# EAGLE design ic-mhm-encoder-v2 (EAGLE 9.6.2)
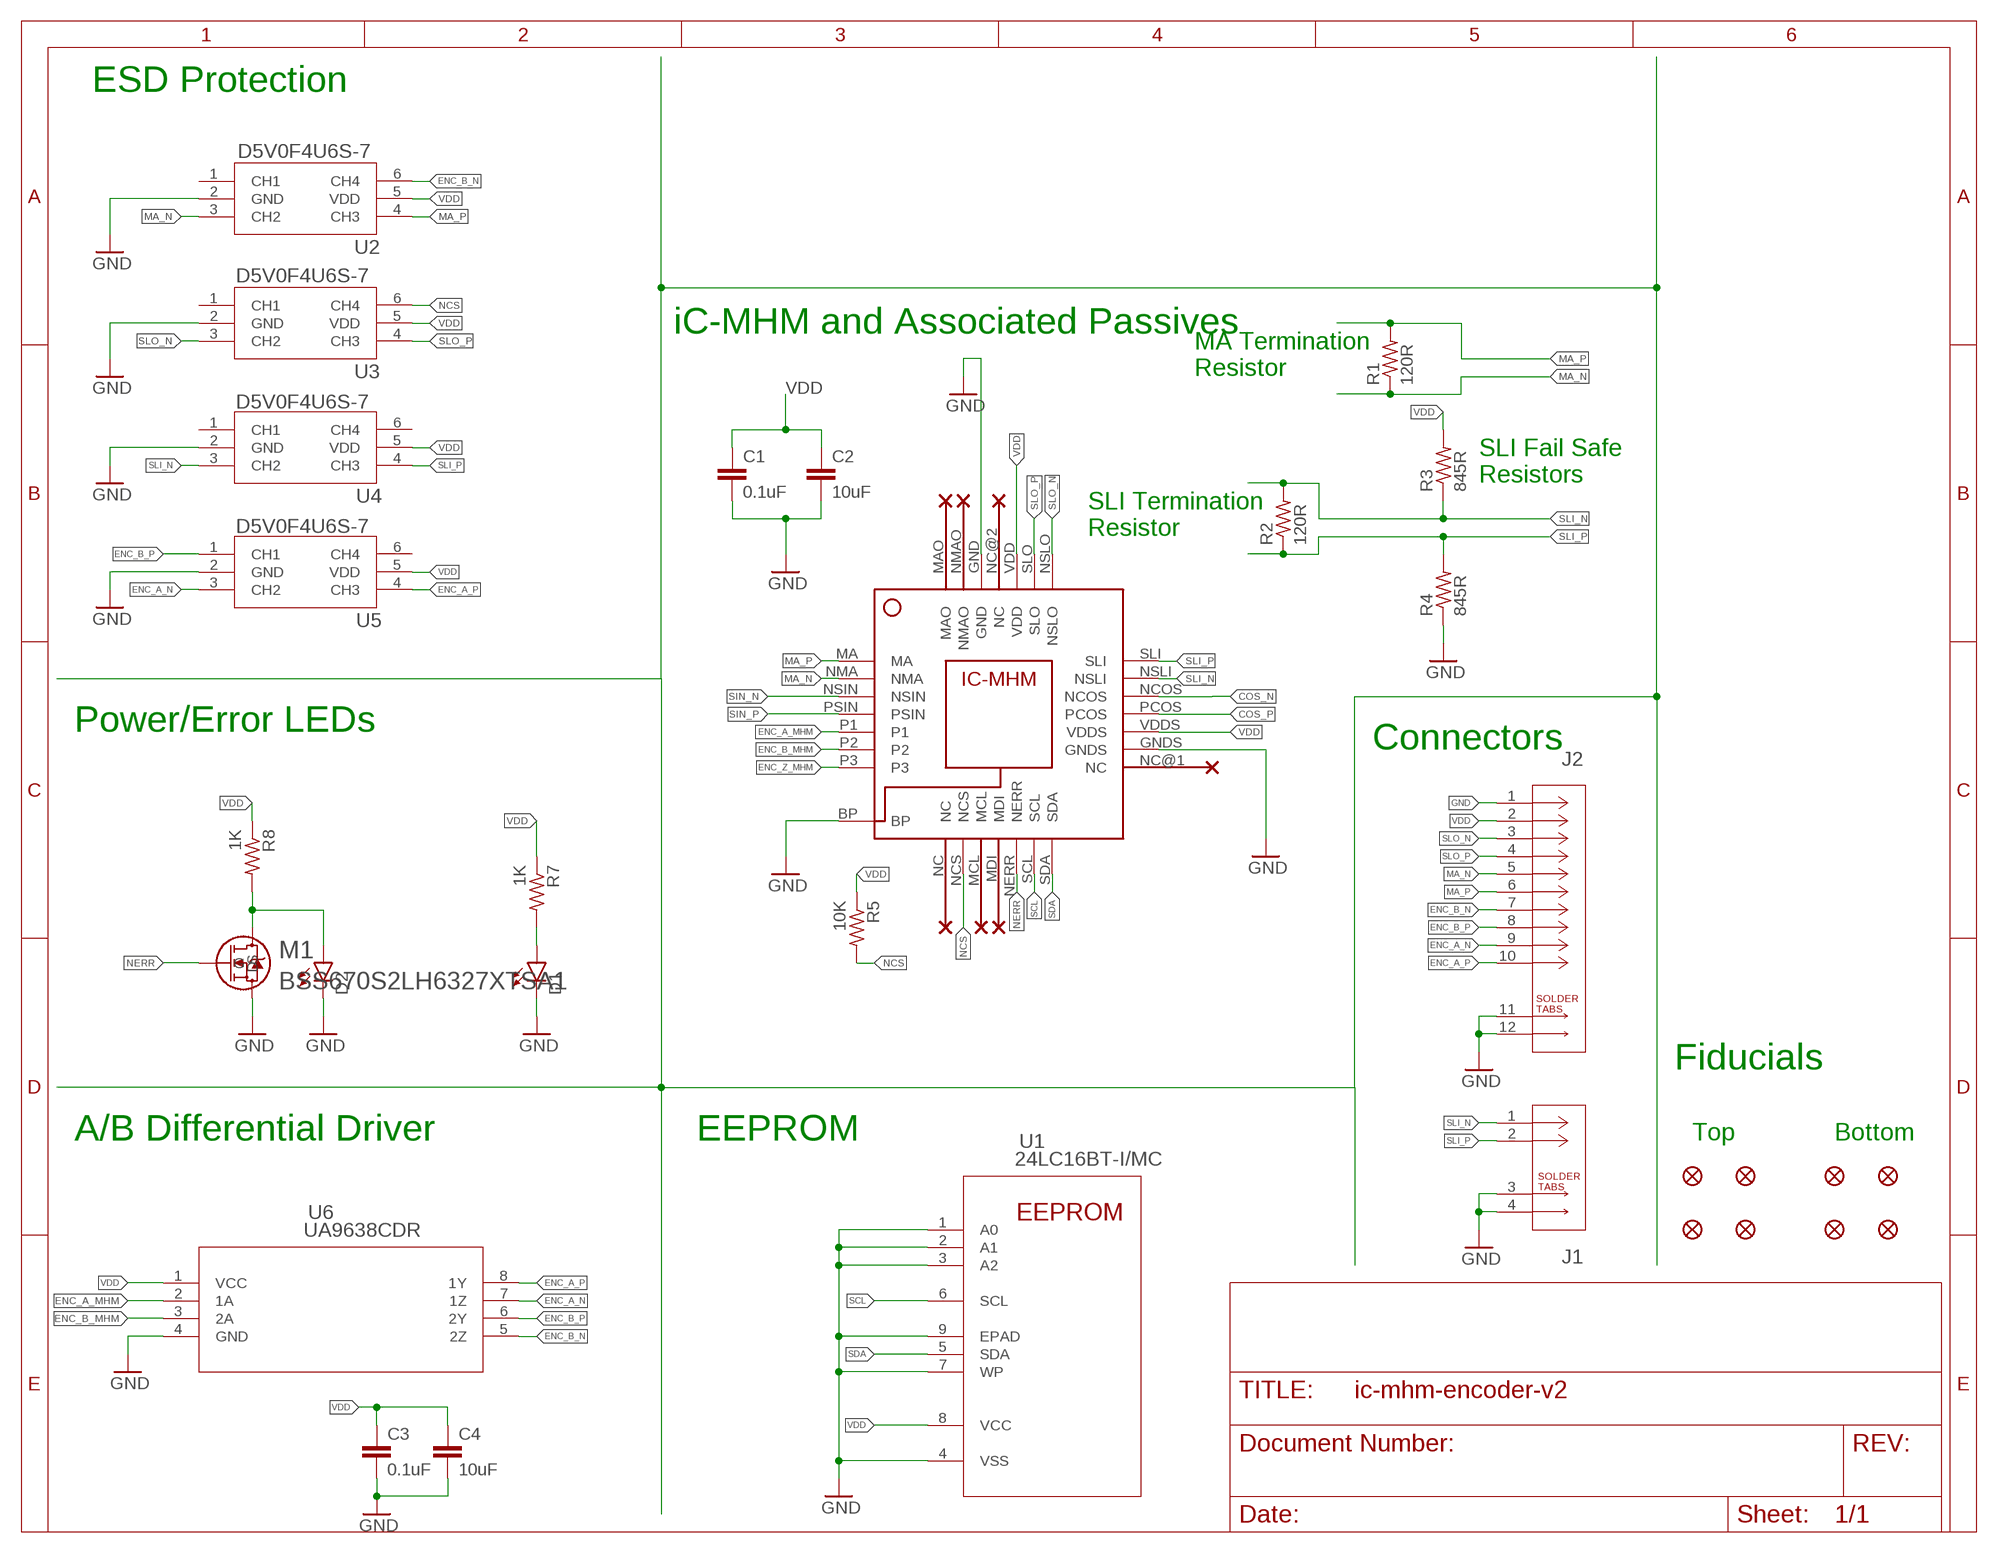
[diagram p0: schematic, sheet 1]

## Parts
C1  0.1uF  C-EUC0603  [C0603]
C2  10uF  C-EUC0603  [C0603]
C3  0.1uF  C-EUC0603  [C0603]
C4  10uF  C-EUC0603  [C0603]
D1  LEDSML0603  [SML0603]
D2  LEDSML0603  [SML0603]
FID1  FIDUCIAL_1MM  [FIDUCIAL_1MM]
FID2  FIDUCIAL_1MM  [FIDUCIAL_1MM]
FID3  FIDUCIAL_1MM  [FIDUCIAL_1MM]
FID4  FIDUCIAL_1MM  [FIDUCIAL_1MM]
FID5  FIDUCIAL_1MM  [FIDUCIAL_1MM]
FID6  FIDUCIAL_1MM  [FIDUCIAL_1MM]
FID7  FIDUCIAL_1MM  [FIDUCIAL_1MM]
FID8  FIDUCIAL_1MM  [FIDUCIAL_1MM]
J1  2023960207  [CON_2023960207]
J2  2023961007  [CON_2023961007]
M1  BSS670S2LH6327XTSA1  [PG-SOT23-3-5_INF]
R1  120R  R-US_R0603  [R0603]
R2  120R  R-US_R0603  [R0603]
R3  845R  R-US_R0603  [R0603]
R4  845R  R-US_R0603  [R0603]
R5  10K  R-US_R0603  [R0603]
R7  1K  R-US_R0603  [R0603]
R8  1K  R-US_R0603  [R0603]
U1  24LC16BT-I/MC  [DFN8_2X3MC_MCH]
U2  D5V0F4U6S-7  [SOT-363_DIO]
U3  D5V0F4U6S-7  [SOT-363_DIO]
U4  D5V0F4U6S-7  [SOT-363_DIO]
U5  D5V0F4U6S-7  [SOT-363_DIO]
U6  UA9638CDR  [D8]
U$1  IC-MHM  [IC-MHM]

## Nets
COS_N [RS422]: U$1.NCOS
COS_P [RS422]: U$1.PCOS
ENC_A_MHM: U6.2(1A) U$1.P1
ENC_A_N [RS422]: J2.9 U5.3(CH2) U6.7(1Z)
ENC_A_P [RS422]: J2.10 U5.4(CH3) U6.8(1Y)
ENC_B_MHM: U6.3(2A) U$1.P2
ENC_B_N [RS422]: J2.7 U2.6(CH4) U6.5(2Z)
ENC_B_P [RS422]: J2.8 U5.1(CH1) U6.6(2Y)
ENC_Z_MHM: U$1.P3
GND: C1.2 C2.2 C3.2 C4.2 D1.C D2.C J1.3 J1.4 J2.1 J2.11 J2.12 M1.2(S) R4.1 U1.1(A0) U1.2(A1) U1.3(A2) U1.4(VSS) U1.7(WP) U1.9(EPAD) U2.2(GND) U3.2(GND) U4.2(GND) U5.2(GND) U6.4(GND) U$1.BP U$1.GND U$1.GNDS
MA_N [RS422]: J2.5 R1.1 U2.3(CH2) U$1.NMA
MA_P [RS422]: J2.6 R1.2 U2.4(CH3) U$1.MA
N$4: D1.A R7.2
N$5: D2.A M1.3(D) R8.2
NCS: R5.2 U3.6(CH4) U$1.NCS
NERR: M1.1(G) U$1.NERR
SCL: U1.6(SCL) U$1.SCL
SDA: U1.5(SDA) U$1.SDA
SIN_N [RS422]: U$1.NSIN
SIN_P [RS422]: U$1.PSIN
SLI_N [RS422]: J1.1 R2.2 R3.1 U4.3(CH2) U$1.NSLI
SLI_P [RS422]: J1.2 R2.1 R4.2 U4.4(CH3) U$1.SLI
SLO_N [RS422]: J2.3 U3.3(CH2) U$1.NSLO
SLO_P [RS422]: J2.4 U3.4(CH3) U$1.SLO
VDD: C1.1 C2.1 C3.1 C4.1 J2.2 R3.2 R5.1 R7.1 R8.1 U1.8(VCC) U2.5(VDD) U3.5(VDD) U4.5(VDD) U5.5(VDD) U6.1(VCC) U$1.VDD U$1.VDDS
Unconnected: U2.1(CH1) U3.1(CH1) U4.1(CH1) U4.6(CH4) U5.6(CH4) U$1.MAO U$1.MCL U$1.MDI U$1.NC U$1.NC@1(NC) U$1.NC@2(NC) U$1.NMAO

## Notes on the sheet
- ESD Protection
- iC-MHM and Associated Passives
- MA Termination
  Resistor
- SLI Fail Safe 
  Resistors
- SLI Termination
  Resistor
- Power/Error LEDs
- Connectors
- Fiducials
- A/B Differential Driver | EEPROM | Top | Bottom

## Library data of the parts
C1-C4 = rcl:C-EU: CAPACITOR, European symbol; SPICEPREFIX: C
D1 D2 = led:LED: LED OSRAM: - CHIPLED LG R971, LG N971, LY N971, LG Q971, LY Q971, LO R971, LY R971 LH N974, LH R974 LS Q976, LO Q976, LY Q976 LO Q996 - Hyper CHIPLED LW Q18S LB Q993, LB Q99A, LB R99A - SideLED LS A670, LO A670, LY A670, LG A670, LP A670 LB A673, LV A673, LT A673, LW A673 LH A674 LY A675 LS A676, LA A676, LO A676, LY A676, LW A676 LS A679, LY A679, LG A679 - Hyper Micro SIDELED® LS Y876, LA Y876, LO Y876, LY Y876 LT Y87S - SmartLED LW L88C, LW L88S LB L89C, LB L89S, LG L890 LS L89K, LO L89K, LY L89K LS L896, LA L896, LO L896, LY L896 - TOPLED LS T670, LO T670, LY T670, LG T670, LP T670 LSG T670, LSP T670, LSY T670, LOP T670, LYG T670 LG T671, LOG T671, LSG T671 LB T673, LV T673, LT T673, LW T673 LH T674 LS T676, LA T676, LO T676, LY T676, LB T676, LH T676, LSB T676, LW T676 LB T67C, LV T67C, LT T67C, LS T67K, LO T67K, LY T67K, LW E67C LS E67B, LA E67B, LO E67B, LY E67B, LB E67C, LV E67C, LT E67C LW T67C LS T679, LY T679, LG T679 LS T770, LO T770, LY T770, LG T770, LP T770 LB T773, LV T773, LT T773, LW T773 LH T774 LS E675, LA E675, LY E675, LS T675 LS T776, LA T776, LO T776, LY T776, LB T776 LHGB T686 LT T68C, LB T68C - Hyper Mini TOPLED® LB M676 - Mini TOPLED Santana® LG M470 LS M47K, LO M47K, LY M47K Source: http://www.osram.convergy.de LUXEON: - LUMILED® LXK2-PW12-R00, LXK2-PW12-S00, LXK2-PW14-U00, LXK2-PW14-V00 LXK2-PM12-R00, LXK2-PM12-S00, LXK2-PM14-U00 LXK2-PE12-Q00, LXK2-PE12-R00, LXK2-PE12-S00, LXK2-PE14-T00, LXK2-PE14-U00 LXK2-PB12-K00, LXK2-PB12-L00, LXK2-PB12-M00, LXK2-PB14-N00, LXK2-PB14-P00, LXK2-PB14-Q00 LXK2-PR12-L00, LXK2-PR12-M00, LXK2-PR14-Q00, LXK2-PR14-R00 LXK2-PD12-Q00, LXK2-PD12-R00, LXK2-PD12-S00 LXK2-PH12-R00, LXK2-PH12-S00 LXK2-PL12-P00, LXK2-PL12-Q00, LXK2-PL12-R00 Source: www.luxeon.com KINGBRIGHT: KA-3528ASYC Source: www.kingbright.com
FID1-FID8 = microbuilder:FIDUCIAL: Fiducial Alignment Points Various fiducial points for machine vision alignment.; BOM: EXCLUDE
J1 = ic-mhm:2023960207; COPYRIGHT: Copyright (C) 2022 Ultra Librarian. All rights reserved.; DIGI-KEY_PART_NUMBER_1: WM26783TR-ND; DIGI-KEY_PART_NUMBER_2: WM26783CT-ND; DIGI-KEY_PART_NUMBER_3: WM26783DKR-ND; MANUFACTURER_PART_NUMBER: 2023960207; MFR_NAME: Molex Connector Corporation
J2 = ic-mhm:2023961007; COPYRIGHT: Copyright (C) 2022 Ultra Librarian. All rights reserved.; DIGI-KEY_PART_NUMBER_1: WM26787TR-ND; DIGI-KEY_PART_NUMBER_2: WM26787CT-ND; DIGI-KEY_PART_NUMBER_3: WM26787DKR-ND; MANUFACTURER_PART_NUMBER: 2023961007; MFR_NAME: Molex Connector Corporation
M1 = ic-mhm:BSS670S2LH6327XTSA1; COPYRIGHT: Copyright (C) 2021 Ultra Librarian. All rights reserved.; DIGI-KEY_PART_NUMBER_1: BSS670S2LH6327XTSA1TR-ND; DIGI-KEY_PART_NUMBER_2: BSS670S2LH6327XTSA1CT-ND; DIGI-KEY_PART_NUMBER_3: BSS670S2LH6327XTSA1DKR-ND; MANUFACTURER_PART_NUMBER: BSS670S2LH6327XTSA1; MFR_NAME: Infineon
R1-R5 R7 R8 = rcl:R-US_: RESISTOR, American symbol; SPICEPREFIX: R
U1 = ic-mhm:24LC16BT-I/MC; COPYRIGHT: Copyright (C) 2021 Ultra Librarian. All rights reserved.; DIGI-KEY_PART_NUMBER_1: 24LC16BT-I/MCCT-ND; DIGI-KEY_PART_NUMBER_2: 24LC16BT-I/MCDKR-ND; DIGI-KEY_PART_NUMBER_3: 24LC16BT-I/MCTR-ND; MANUFACTURER_PART_NUMBER: 24LC16BT-I/MC; MFR_NAME: Microchip
U2-U5 = ic-mhm:D5V0F4U6S-7; COPYRIGHT: Copyright (C) 2021 Ultra Librarian. All rights reserved.; DIGI-KEY_PART_NUMBER_1: 31-D5V0F4U6S-7CT-ND; DIGI-KEY_PART_NUMBER_2: 31-D5V0F4U6S-7DKR-ND; DIGI-KEY_PART_NUMBER_3: 31-D5V0F4U6S-7TR-ND; DIGI-KEY_PART_NUMBER_4: D5V0F4U6S-7-ND; DIGI-KEY_PART_NUMBER_5: D5V0F4U6S-7DICT-ND; DIGI-KEY_PART_NUMBER_6: D5V0F4U6S-7DIDKR-ND; DIGI-KEY_PART_NUMBER_7: D5V0F4U6S-7DITR-ND; MANUFACTURER_PART_NUMBER: D5V0F4U6S-7; MFR_NAME: Diodes Inc
U6 = ic-mhm:UA9638CDR; COPYRIGHT: Copyright (C) 2022 Ultra Librarian. All rights reserved.; DIGI-KEY_PART_NUMBER_1: 296-15058-1-ND; DIGI-KEY_PART_NUMBER_2: 296-15058-2-ND; DIGI-KEY_PART_NUMBER_3: 296-15058-6-ND; DIGI-KEY_PART_NUMBER_4: 2156-UA9638CDR-ND; MANUFACTURER_PART_NUMBER: UA9638CDR; MFR_NAME: Texas Instruments
U$1 = ic-mhm:IC-MHM

## Net classes
1 RS422: width 0.152 mm, clearance 0.254 mm

## Board
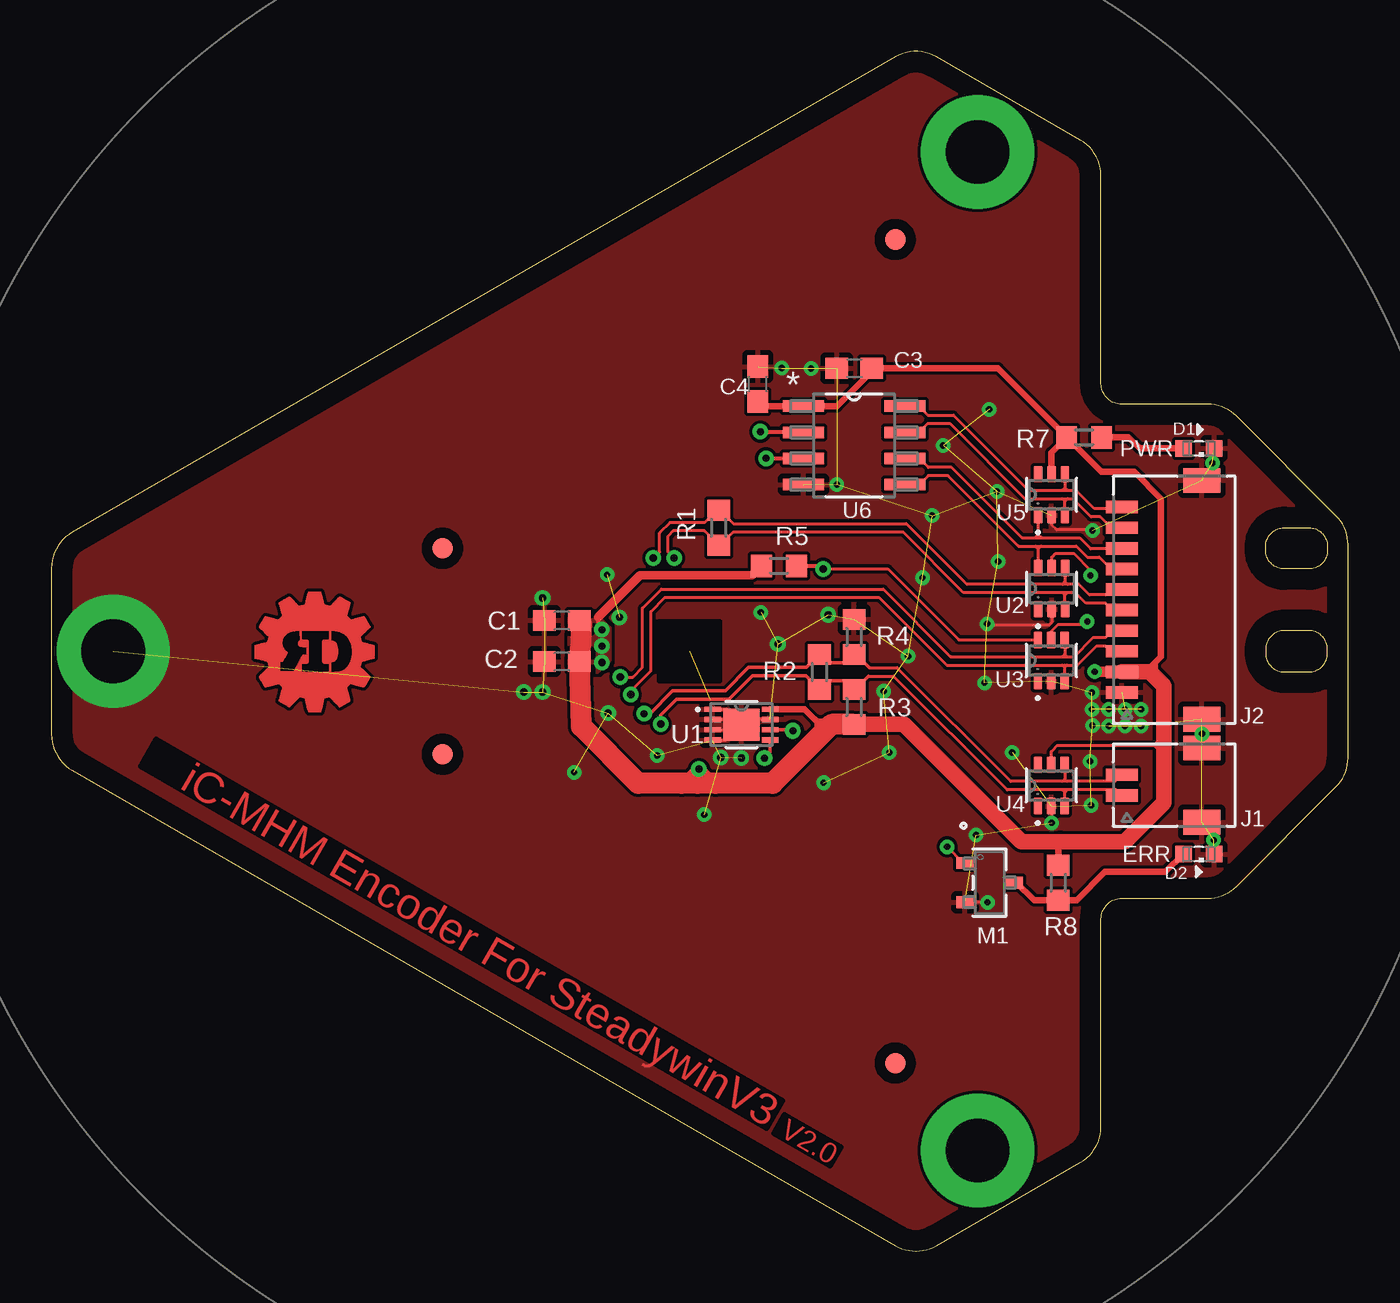
[diagram p1: board, top side]
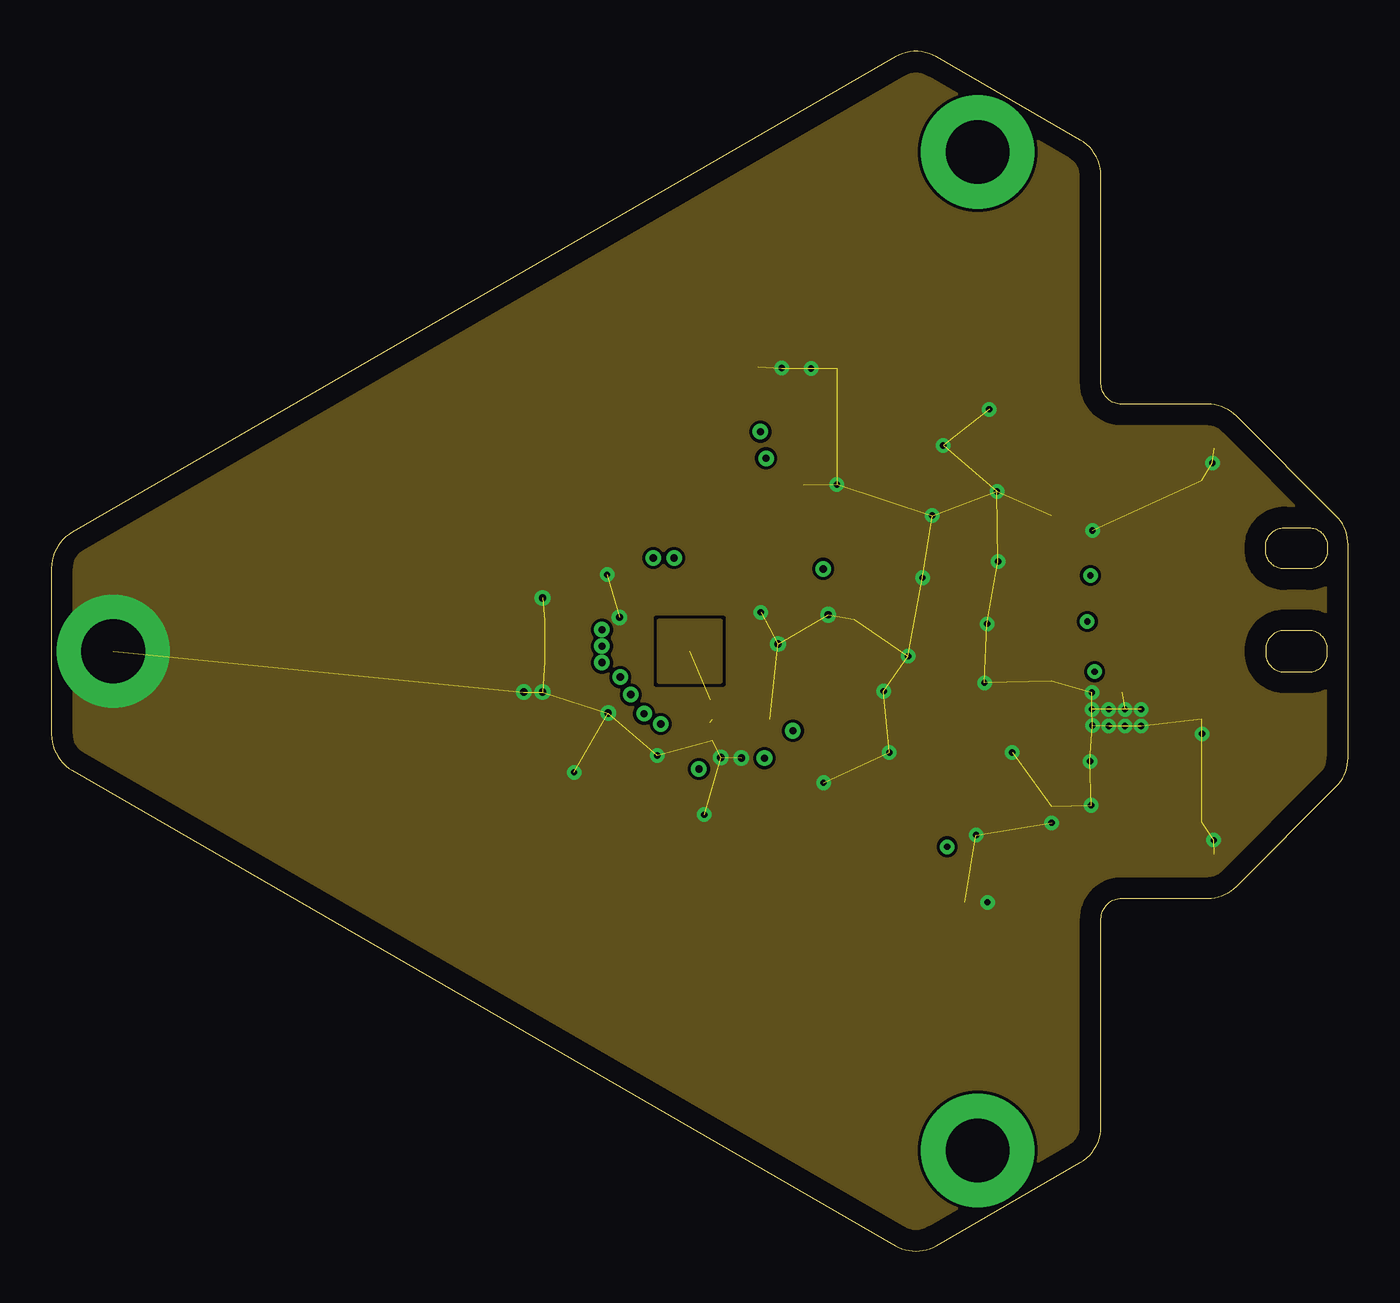
[diagram p2: board, inner layer Route2]
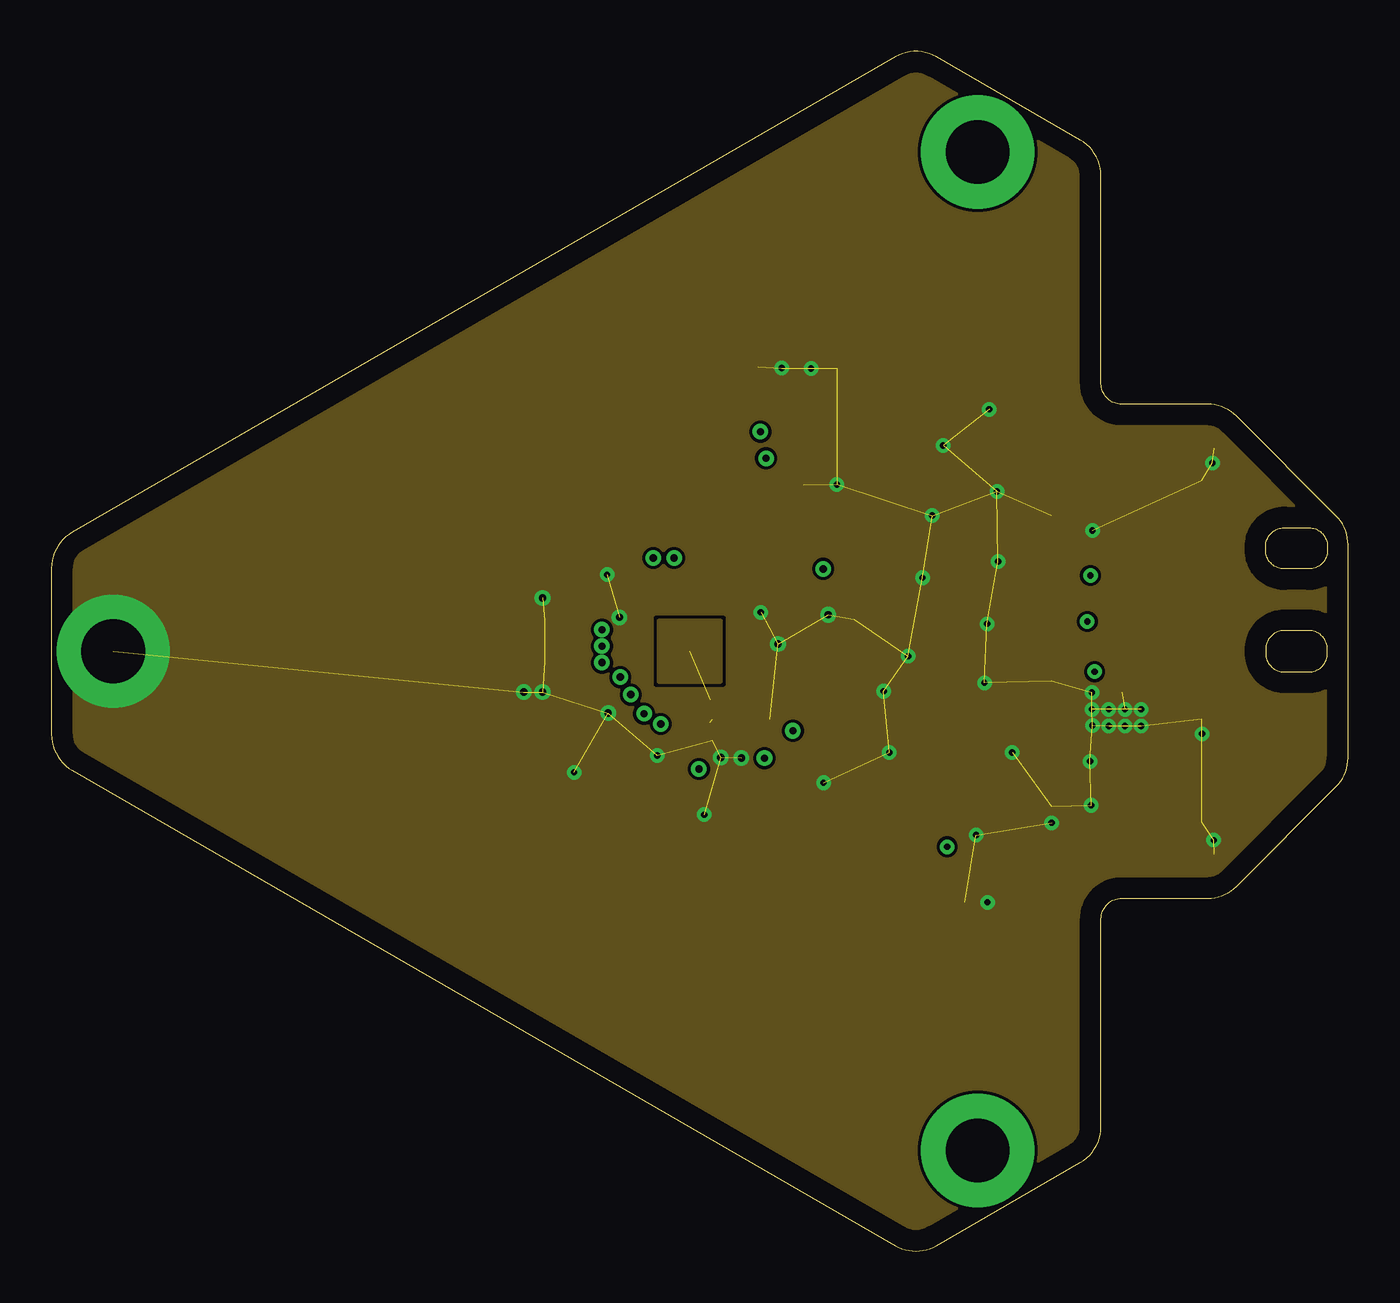
[diagram p3: board, inner layer Route15]
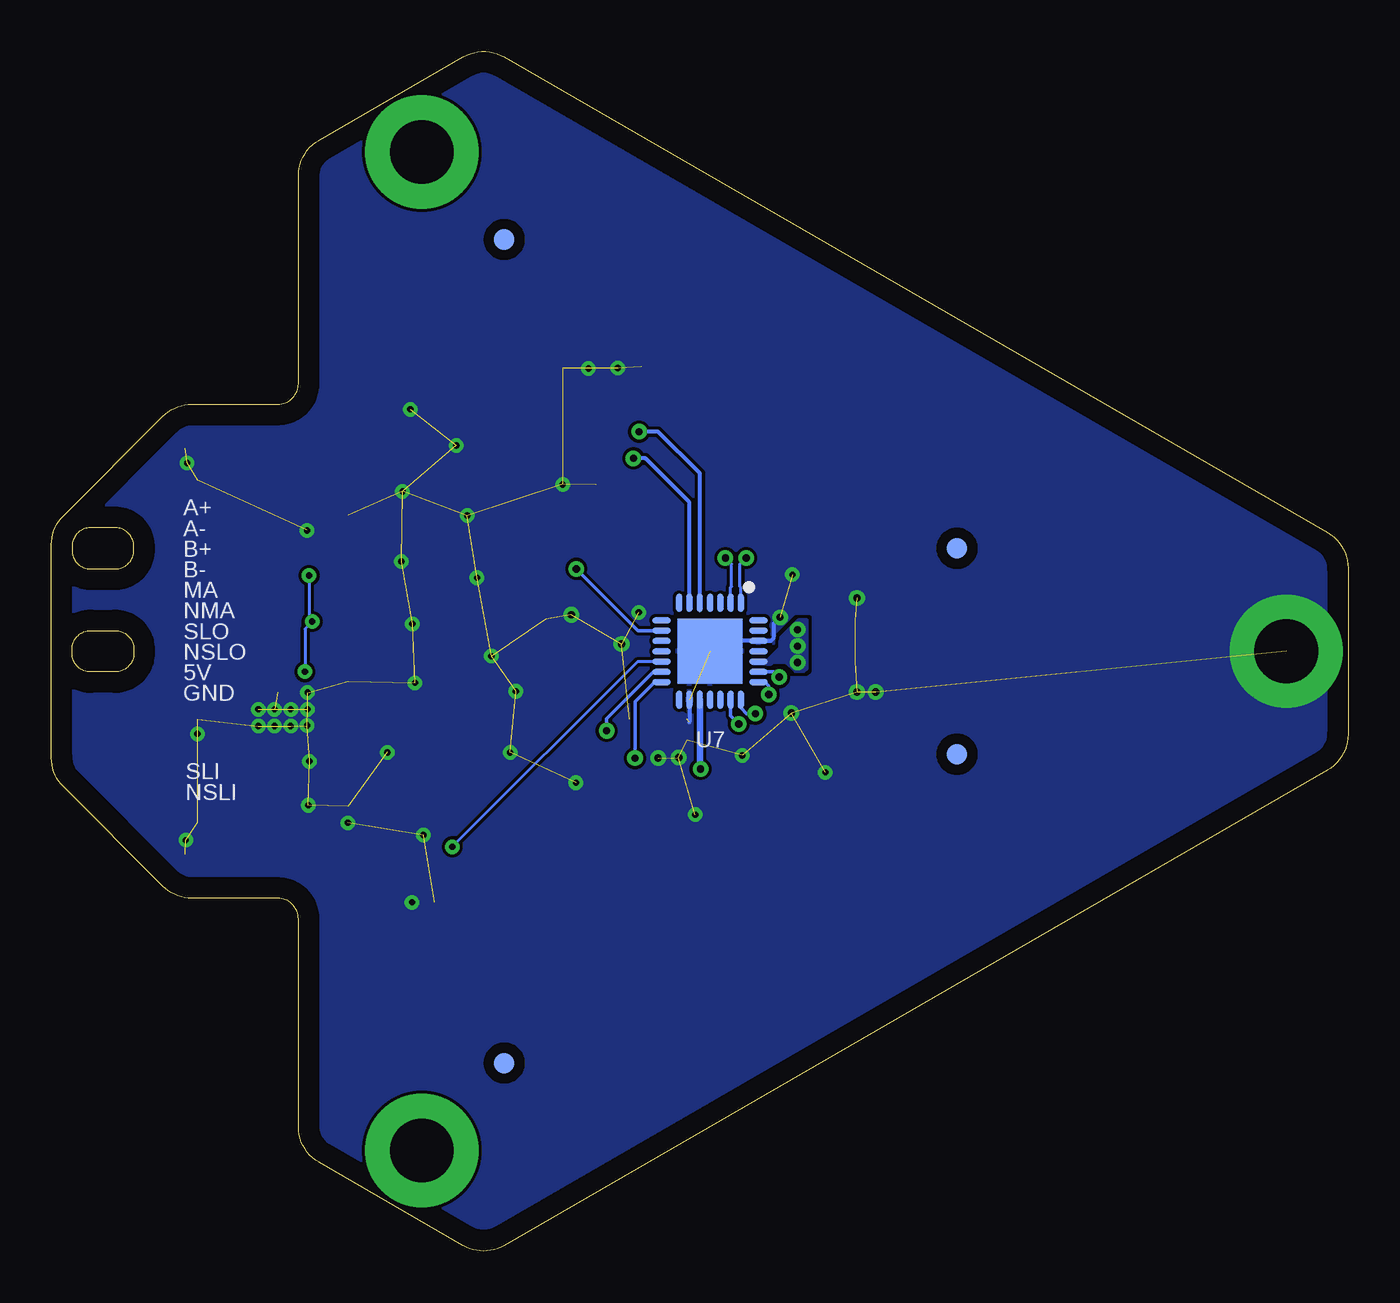
[diagram p4: board, bottom side, seen from below]

Size 63 x 58.27 mm. Coordinates in mm from the lower left corner, seen from the top.
Outline: 51,42.14 51,52.23 arc60 50,53.96 43,58 arc60 41,58 1,34.91 arc60 0,33.18 0,25.09 arc60 1,23.36 41,0.27 arc60 43,0.27 50,4.31 arc60 51,6.04 51,16.14 arc-90 52,17.14 56.17,17.14 arc45 57.59,17.72 62.41,22.55 arc45 63,23.96 63,34.31 arc45 62.41,35.72 57.59,40.55 arc45 56.17,41.14 52,41.14 arc-90 51,42.14
Outline: 59.9,35.14 61.1,35.14 arc-90 62,34.24 62,34.04 arc-90 61.1,33.14 59.9,33.14 arc-90 59,34.04 59,34.24 arc-90 59.9,35.14
Outline: 61.1,30.14 59.9,30.14 arc90 59,29.24 59,29.04 arc90 59.9,28.14 61.1,28.14 arc90 62,29.04 62,29.24 arc90 61.1,30.14
Copper layers (1+2*15+16): Top 0.035mm / dielectric 0.18mm / Route2 0.035mm / dielectric 1.5mm / Route15 0.035mm / dielectric 0.18mm / Bottom 0.035mm
Design rules "default *": minimum track width 6mil, minimum drill 0.3mm, track to track 6mil, track to pad 6mil, pad to pad 6mil, via to via 6mil, smd to smd 6mil, copper to edge 40mil, drill to drill 6mil, minimum pad ring 10mil, minimum via ring 8mil, stop-mask expansion 4mil, vias tented up to drill 25mil, thermal gap 10mil
tRestrict: area 29.5,27.6 to 32.5,30.6
bRestrict: 5 lines

### Footprints (pad centres in the part's own frame; a part is rotated, then mirrored left to right if it is on the bottom)
C0603 = smd 1.1 x 1: 1 -0.85,0; 2 0.85,0
SML0603 = smd 0.8 x 0.8: A 0.75,0; C -0.75,0
FIDUCIAL_1MM = smd 1 x 1: 1 0,0
CON_2023960207 = smd 0.6 x 1.55: 1 0,0; 2 1,0 | smd 1.2 x 1.8: 3 -1.3,-3.9; 4 2.3,-3.9
CON_2023961007 = smd 0.6 x 1.55: 1 0,0; 2 1,0; 3 2,0; 4 3,0; 5 4,0; 6 5,0; 7 6,0; 8 7,0; 9 8,0; 10 9,0 | smd 1.2 x 1.8: 11 -1.3,-3.9; 12 10.3,-3.9
PG-SOT23-3-5_INF = smd 0.568 x 0.852: 1 -0.95,-1.194; 2 0.95,-1.194; 3 0,1.194
R0603 = smd 1 x 1.1: 1 -0.85,0; 2 0.85,0
DFN8_2X3MC_MCH = smd 0.808 x 0.255: 1 -1.395,0.75; 2 -1.395,0.25; 3 -1.395,-0.25; 4 -1.395,-0.75; 5 1.395,-0.75; 6 1.395,-0.25; 7 1.395,0.25; 8 1.395,0.75 | smd 1.753 x 1.549: 9 0,0
SOT-363_DIO = smd 0.8 x 0.42: 1 -1,0.65; 2 -1,0; 3 -1,-0.65; 4 1,-0.65; 5 1,0; 6 1,0.65
D8 = smd 1.981 x 0.559: 1 -2.464,1.905; 2 -2.464,0.635; 3 -2.464,-0.635; 4 -2.464,-1.905; 5 2.464,-1.905; 6 2.464,-0.635; 7 2.464,0.635; 8 2.464,1.905
IC-MHM = smd 3.15 x 3.15: BP 0,0 | smd 0.3 x 0.9: GND -0.5,2.35; MAO -1.5,2.35; MCL -0.5,-2.35; MDI 0,-2.35; NC -1.5,-2.35; NC@2 0,2.35; NCS -1,-2.35; NERR 0.5,-2.35; NMAO -1,2.35; NSLO 1.5,2.35; SCL 1,-2.35; SDA 1.5,-2.35; SLO 1,2.35; VDD 0.5,2.35 | smd 0.9 x 0.3: GNDS 2.35,-1; MA -2.35,1.5; NC@1 2.35,-1.5; NCOS 2.35,0.5; NMA -2.35,1; NSIN -2.35,0.5; NSLI 2.35,1; P1 -2.35,-0.5; P2 -2.35,-1; P3 -2.35,-1.5; PCOS 2.35,0; PSIN -2.35,0; SLI 2.35,1.5; VDDS 2.35,-0.5

### Placement (x,y rotation side)
C1  24.8,30.64 180 top
C2  24.8,28.64 180 top
C3  39.01,42.88 180 top
C4  34.32,42.11 90 top
D1  55.75,38.99 180 top
D2  55.75,19.29 180 top
FID1  41,9.14 0 top
FID2  19,24.14 0 top
FID3  19,34.14 0 top
FID4  41,49.14 0 top
FID5  19,34.14 0 bottom
FID6  19,24.14 0 bottom
FID7  41,49.14 0 bottom
FID8  41,9.14 0 bottom
J1  52,22.14 90 top
J2  52,27.14 90 top
M1  45.58,17.9 270 top
R1  32.42,35.14 90 top
R2  37.31,28.14 270 top
R3  39,26.44 270 top
R4  39,29.84 270 top
R5  35.35,33.29 0 top
R7  50.18,39.52 0 top
R8  48.92,17.89 270 top
U1  33.53,25.57 0 top
U2  48.6,32.18 90 top
U3  48.58,28.69 90 top
U4  48.58,22.62 90 top
U5  48.59,36.74 90 top
U6  39,39.14 0 top
U$1  31,29.14 270 bottom

### Tracks (layer width: path | path; a pad name or v marks a point on that pad's centre or on a via)
ENC_A_MHM  (via drill 0.35)
  Top 0.203: v34.44,39.8 36.5,39.8 U6.2
  Bottom 0.203: U$1.P1 31.5,37.77 33.53,39.8 v34.44,39.8
ENC_A_N
  Top 0.152: U6.7 42.15,39.77 42.58,40.2 43.66,40.2 47.31,36.55 49.11,36.55 | 49.11,36.55 49.37,36.55 | 49.37,36.55 49.62,36.55 50.51,35.66 50.96,35.66 51.49,35.14 J2.9 | U5.3 49.24,36.42 | 49.24,36.42 49.11,36.55 | 49.24,36.42 49.37,36.55
ENC_A_P
  Top 0.152: U6.8 42.15,41.04 42.58,40.61 43.82,40.61 47.47,36.96 49.11,36.96 | 49.11,36.96 49.36,36.96 | 49.36,36.96 49.79,36.96 50.68,36.07 51.45,36.07 51.52,36.14 J2.10 | U5.4 49.24,37.09 | 49.24,37.09 49.11,36.96 | 49.24,37.09 49.24,37.08 49.36,36.96
ENC_B_MHM  (via drill 0.35)
  Top 0.203: v34.72,38.51 34.73,38.5 U6.3
  Bottom 0.203: U$1.P2 32,36.37 34.14,38.51 v34.72,38.51
ENC_B_N
  Top 0.152: U6.5 42.18,37.23 42.61,37.66 43.56,37.66 46.99,34.24 47.81,34.24 | 47.81,34.24 48.08,34.24 | 48.08,34.24 49.8,34.24 50.33,33.71 50.91,33.71 51.28,33.34 51.8,33.34 J2.7 | U2.6 47.95,34.11 | 47.95,34.11 47.81,34.24 | 47.95,34.11 48.08,34.24
ENC_B_P
  Top 0.152: U6.6 42.18,38.5 42.61,38.07 43.73,38.07 47.15,34.65 47.79,34.65 | 47.79,34.65 48.09,34.65 | 48.09,34.65 49.96,34.65 50.5,34.11 51.5,34.11 51.52,34.14 J2.8 | 47.94,34.8 47.79,34.65 | U5.1 47.94,34.8 | 47.94,34.8 48.09,34.65
GND  (via drill 0.3, 0.35, 3.1 pad 5.5)  (64 unrouted)
  Top 0.152: U1.7 34.51,25.82 34.51,25.83 34.06,25.83 | 34.06,25.83 33.78,25.83 | U1.9 34.31,25.57 34.08,25.8 | U1.1 32.77,26.32 U1.9 | 34.08,25.8 32.15,25.8 U1.2 | 34.06,25.83 34.08,25.8 | U1.3 32.16,25.3 33.25,25.3 U1.9 | U1.4 32.77,24.82 U1.9 | U5.2 48.59,35.28 48.84,35.03 50.56,35.03 v50.58,35 | U4.2 48.58,20.82 v48.6,20.8 | v45.48,16.94 v45.48,16.95 M1.2 | U2.2 48.6,30.55 48.45,30.41 45.53,30.41 v45.46,30.47
  Bottom 0.152: U$1.BP 30.65,29.49 30.65,29.74
  Bottom 0.203: 30.65,29.74 30.55,29.64 U$1.GND 28.05,29.64 27.9,29.79 27.9,30.49 v27.6,30.79 | U$1.GNDS 32,25.69
  other vias: 3,29.14 35.3,29.49 27.05,26.14 32.52,23.97 33.53,23.95 37.74,30.91 23.86,27.15 23.86,31.73 22.95,27.15 50.56,27.13 50.56,26.32 51.37,26.32 52.16,26.32 52.95,26.32 52.95,25.5 52.16,25.5 51.37,25.5 50.58,25.53 56.48,19.96 56.41,38.28 55.9,25.13 36.91,42.87 45.56,40.88 43.33,39.13 45.94,36.9 42.8,35.73 46,33.49 42.32,32.71 41.63,28.9 45.34,27.6 46.68,24.22 40.43,27.19 50.52,21.66 50.47,23.79 40.71,24.22 44.93,20.21 25.4,23.26 31.72,21.2 37.51,22.75 27,32.86 34.46,31.03 29.43,24.08 38.16,37.24 35.48,42.89
  pour Bottom (rank 5): -4,59.14 71,59.14 71,-5.86 -4,-5.86
  pour Route2 (rank 5): -4,59.14 -4,-5.86 76,-5.86 76,59.14
  pour Route15 (rank 5): -4,59.14 -4,-5.86 81,-5.86 81,59.14
  pour Top (rank 5): -4,59.14 -4,-5.86 86,-5.86 86,59.14
MA_N  (via drill 0.35)
  Top 0.152: v30.25,33.67 29.95,33.97 29.95,34.72 30.21,34.98 31.72,34.98 R1.1 32.48,34.29 33.13,34.93 41.37,34.93 44.32,31.98 49.14,31.98 | J2.5 51.55,31.14 51.22,31.47 50.26,31.47 49.75,31.98 49.36,31.98 | 49.36,31.98 49.14,31.98 | U2.3 49.25,31.87 | 49.25,31.87 49.14,31.98 | 49.25,31.87 49.36,31.98
  Bottom 0.152: U$1.NMA 30,32.24 29.95,32.29 29.95,33.36 v30.25,33.67
MA_P  (via drill 0.35)
  Top 0.152: v29.24,33.67 29.55,33.97 29.55,34.89 30.04,35.38 31.74,35.38 32.34,35.99 R1.2 32.48,35.99 33.13,35.34 41.54,35.34 44.49,32.39 49.14,32.39 | J2.6 51.47,32.14 51.21,31.88 50.43,31.88 49.92,32.39 49.36,32.39 | 49.36,32.39 49.14,32.39 | U2.4 49.25,32.5 | 49.25,32.5 49.14,32.39 | 49.25,32.5 49.36,32.39
  Bottom 0.152: U$1.MA 29.5,32.24 29.55,32.29 29.55,33.36 v29.24,33.67
N$1  (via drill 3.1 pad 5.5)
  other vias: 45,53.38
N$2  (via drill 3.1 pad 5.5)
  other vias: 45,4.89
N$4
  Top 0.305: R7.2 52.33,39.52 52.87,38.99 D1.A
N$5
  Top 0.305: M1.3 46.9,17.9 47.75,17.04 R8.2 49.82,17.04 51.19,18.42 54.13,18.42 D2.A
NC_1
  pour Route2: 29.5,30.66 32.52,30.66 32.52,27.64 32.5,27.61 29.5,27.61
  pour Route15: 29.5,30.66 32.52,30.66 32.52,27.64 32.5,27.61 29.5,27.61
NCS  (via drill 0.35)
  Top 0.152: U3.6 44.09,29.69 40.64,33.14 v37.5,33.14
  Top 0.203: R5.2 37.35,33.29 v37.5,33.14
  Bottom 0.159: U$1.NCS 34.5,30.14 v37.5,33.14
NERR  (via drill 0.3)
  Top 0.152: M1.1 44.31,18.85 v43.52,19.64
  Bottom 0.152: U$1.NERR 34.52,28.64 v43.52,19.64
SCL  (via drill 0.35)
  Top 0.159: v36.02,25.27 35.97,25.33 U1.6
  Bottom 0.159: U$1.SCL 33.75,28.14 36.02,25.86 v36.02,25.27
SDA  (via drill 0.35)
  Top 0.159: v34.64,23.95 34.92,24.22 U1.5
  Bottom 0.159: U$1.SDA 33.7,27.64 34.64,26.69 v34.64,23.95
SLI_N  (via drill 0.35)
  Top 0.152: J1.1 51.73,22.4 49.34,22.4 | 49.34,22.4 49.11,22.4 | 49.11,22.4 46.44,22.4 40.92,27.93 39.71,27.93 | U4.3 49.23,22.13 49.23,22.28 | 49.23,22.28 49.11,22.4 | 49.23,22.28 49.23,22.3 49.34,22.4
  Top 0.159: v29.6,25.6 29.6,26.04 30.37,26.8 32.93,26.8 34.07,27.94 36.66,27.94 R2.2 37.72,27.69 38.59,27.69 R3.1 39.06,27.29 39.71,27.93
  Bottom 0.159: U$1.NSLI 30,26 v29.6,25.6
SLI_P  (via drill 0.35)
  Top 0.152: J1.2 51.67,22.81 49.34,22.81 | 49.34,22.81 49.11,22.81 | 49.11,22.81 46.61,22.81 41.08,28.34 39.73,28.34 | U4.4 49.23,22.93 | 49.23,22.93 49.11,22.81 | 49.23,22.93 49.23,22.92 49.34,22.81
  Top 0.159: v28.79,26.1 29.07,26.1 30.18,27.21 32.74,27.21 33.88,28.35 36.68,28.35 R2.1 37.72,28.58 38.59,28.58 R4.2 39.09,28.99 39.73,28.34
  Bottom 0.159: v28.79,26.1 29.22,26.1 29.5,26.39 U$1.SLI
SLO_N  (via drill 0.35)
  Top 0.152: 28.15,27.21 29.12,28.18 29.12,31.07 29.81,31.75 40.22,31.75 43.5,28.47 49.11,28.47 | 49.11,28.47 49.24,28.47 | 49.24,28.47 49.33,28.47 | 49.34,28.47 49.85,28.47 50.78,29.39 51.22,29.39 51.47,29.14 J2.3 | U3.3 49.23,28.35 | 49.23,28.35 49.23,28.46 49.24,28.47 | 49.23,28.35 49.22,28.36 | 49.22,28.36 49.11,28.47 | 49.33,28.47 49.22,28.36 | 49.33,28.47 49.34,28.47 | 49.22,28.36 49.23,28.36 49.34,28.47
  Top 0.159: v28.15,27.03 28.15,27.21
  Bottom 0.159: U$1.NSLO 28.33,27.64 28.15,27.45 v28.15,27.03
SLO_P  (via drill 0.35)
  Top 0.152: v27.64,27.88 28.25,27.88 28.71,28.35 28.71,31.23 29.64,32.16 40.41,32.16 43.69,28.88 49.11,28.88 | 49.11,28.88 49.34,28.88 | 49.34,28.88 49.69,28.88 50.61,29.8 51.22,29.8 51.56,30.14 J2.4 | U3.4 49.23,29 | 49.23,29 49.23,28.99 49.34,28.88 | 49.23,29 49.11,28.88
  Top 0.159: v27.64,27.88
  Bottom 0.159: U$1.SLO 27.9,28.14 v27.64,27.88
VDD  (via drill 0.3, 0.35)
  Top 0.152: 37.23,25.38 37.23,24.91 37.12,25.02 37.12,25.8 37.68,25.8 37.9,25.59 | 37.1,25.82 37.23,25.69 37.23,25.38 | 37.38,25.54 37.23,25.38 | U3.5 48.58,30.1 48.9,30.43 50.17,30.43 v50.33,30.58 | U2.5 48.6,33.7 48.78,33.89 49.67,33.89 50.48,33.07 v50.48,32.82 | U4.5 48.58,24.26 48.88,24.56 53.55,24.56 | 53.55,24.56 53.73,24.74 | 53.55,24.56 54.04,24.08 54.04,24
  Top 0.203: 26.55,30.79 26.55,30.39 v26.75,30.19
  Top 0.305: U1.8 36.6,26.32 37.1,25.82 37.12,25.8 37.38,25.54 37.62,25.3 | v31.46,23.42 31.46,22.77 31.41,22.72 | v31.46,23.42 31.28,23.42 30.62,22.76 30.62,22.72 | v31.46,23.42 31.63,23.42 32.27,22.79 32.27,22.72 | R7.1 48.59,38.78 U5.5 | R7.1 51.01,37.85 52.61,37.85 53.91,36.55 53.91,28.87 53.62,28.58 | 53.62,28.58 53.17,28.14 | 53.68,27.81 53.62,27.87 53.62,28.58 | R8.1 48.92,19.81 49,19.89 | R7.1 45.97,42.88 C3.1 39.86,42.74 38.15,41.04 U6.1 34.55,41.04 C4.1
  Top 0.406: R5.1 34.04,32.83 28.59,32.83 26.55,30.79
  Top 0.508: J2.2 50.69,28.14 v50.68,28.14
  Top 0.762: R3.2 41.43,25.59 47.13,19.89 49,19.89 52.16,19.89 54.04,21.77 54.04,24 54.04,27.46 53.68,27.81 53.36,28.14 53.17,28.14 J2.2
  Top 1.016: R3.2 37.9,25.59 37.62,25.3 37.23,24.91 35.04,22.72 32.27,22.72 31.41,22.72 30.62,22.72 28.51,22.72 25.75,25.49 C2.1 25.75,30.54 C1.1
  Bottom 0.152: v50.68,28.14 50.68,30.23 v50.33,30.58 50.48,30.74 v50.48,32.82
  Bottom 0.305: U$1.VDDS 31.5,23.46 v31.46,23.42
  other vias: 26.75,29.39 26.75,28.59
  pour Top: 25.15,31.09 26.35,31.09 27.15,30.29 27.15,28.69 26.4,27.94 25.15,27.94
  pour Bottom (no thermals): 28.9,28.74 28.2,28.74 28.05,28.89 27.6,29.34 27.6,29.79 26.7,30.69 26.3,30.69 26.3,28.29 26.45,28.14 26.85,28.14 27.3,28.59 27.95,28.59 28.05,28.49 28.85,28.49 28.9,28.54 28.9,28.69
(copper drawn outside any net)
  shapes: Top area x1131

### Text on the board
Top: iC-MHM Encoder For SteadywinV3 | V2.0
tPlace: PWR | ERR
bPlace: A+ / A- / B+ / B- / MA / NMA / SLO / NSLO / 5V / GND | U7 | SLI / NSLI
tStop: iC-MHM Encoder For SteadywinV3 | V2.0
Reference: Keep within purple circle / A/B differential RS422 5v / switch to pico-lock connectors / strain releif? / Change to 1 connector? (13pins?)